# Altium schematic sheet warship_demo_1.SchDoc
size A4
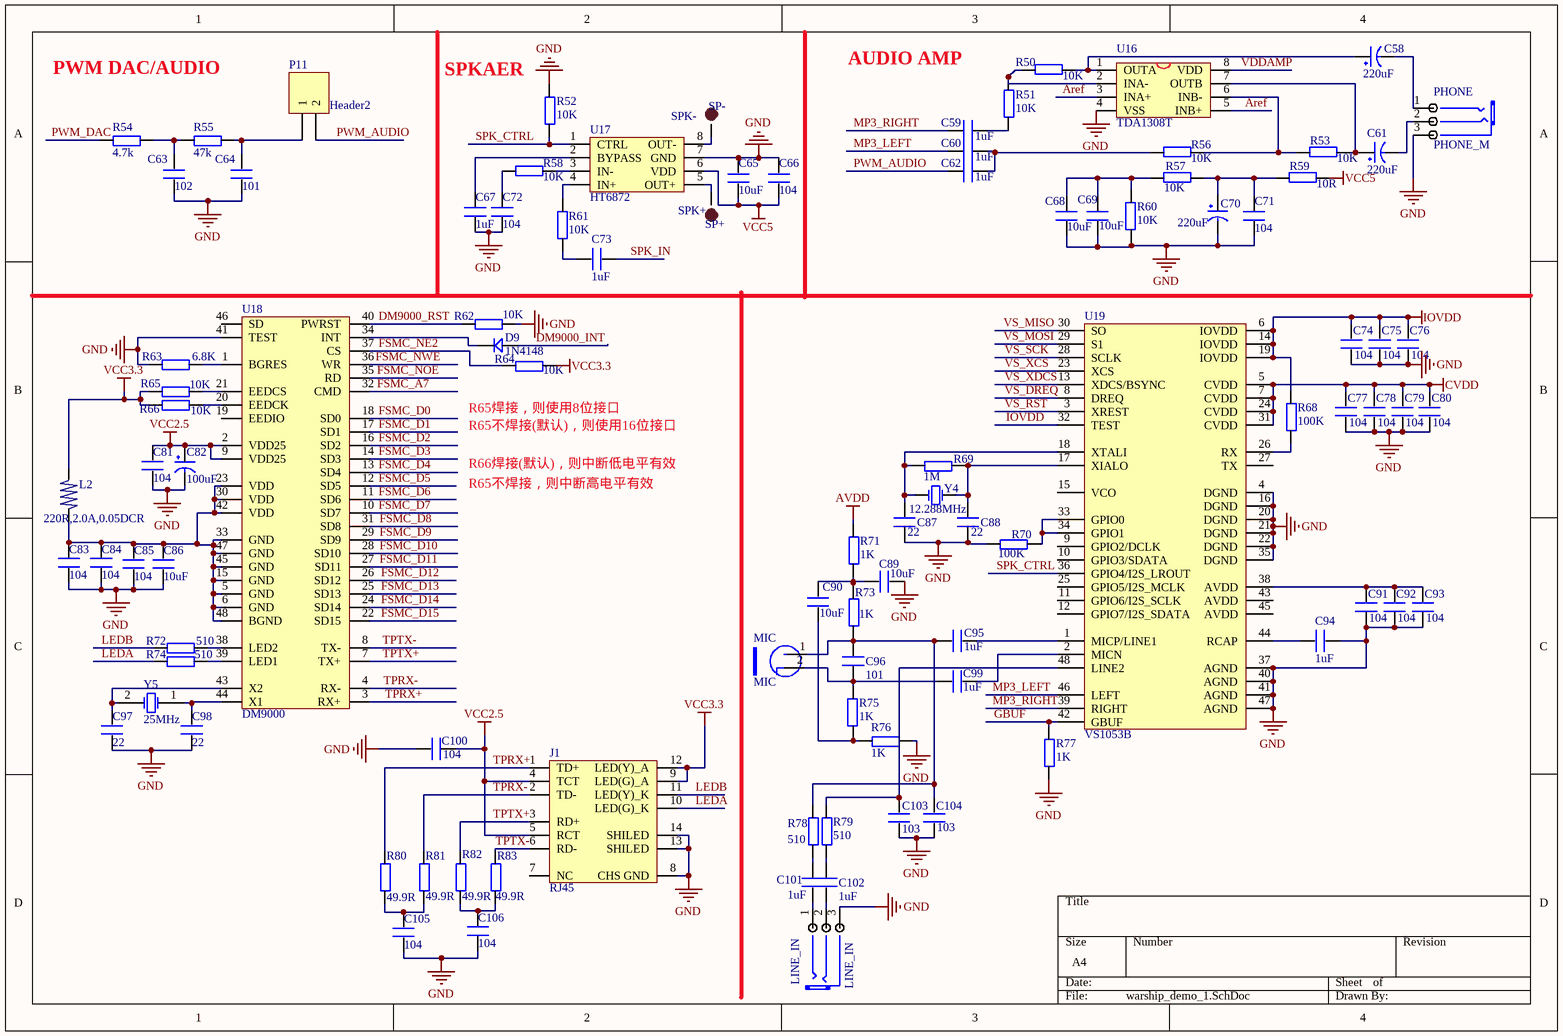
[diagram p0: warship_demo_1.SchDoc]

## Parts
C58  220uF  [CC6.56.5]
C59  1uF  [0603P]
C60  1uF  [0603P]
C61  220uF  [CC6.56.5]
C62  1uF  [0603P]
C63  102  [0603P]
C64  101  [0603P]
C65  10uF  [0603P]
C66  104  [0603P]
C67  1uF  [0603P]
C68  10uF  [0603P]
C69  10uF  [0603P]
C70  220uF  [CC6.56.5]
C71  104  [0603P]
C72  104  [0603P]
C73  1uF  [0603P]
C74  104  [0603P]
C75  104  [0603P]
C76  104  [0603P]
C77  104  [0603P]
C78  104  [0603P]
C79  104  [0603P]
C80  104  [0603P]
C81  104  [0603P]
C82  100uF  [CC6.56.5]
C83  104  [0603P]
C84  104  [0603P]
C85  104  [0603P]
C86  10uF  [0603P]
C87  22  [0603P]
C88  22  [0603P]
C89  10uF  [0603P]
C90  10uF  [0603P]
C91  104  [0603P]
C92  104  [0603P]
C93  104  [0603P]
C94  1uF  [0603P]
C95  1uF  [0603P]
C96  101  [0603P]
C97  22  [0603P]
C98  22  [0603P]
C99  1uF  [0603P]
C100  104  [0603P]
C101  1uF  [0603P]
C102  1uF  [0603P]
C103  103  [0603P]
C104  103  [0603P]
C105  104  [0603P]
C106  104  [0603P]
D9  1N4148  [DIODE_SOP]
J1  RJ45  [HR911105A]
L2  220R,2.0A,0.05DCR  [0603P]
LINE_IN  LINE_IN  [PHONE_ST]
MIC  MIC  [MIC]
P11  Header2  [HDR1X2]
PHONE  PHONE_M  [PHONE_ST]
R50  10K  [0603P]
R51  10K  [0603P]
R52  10K  [0603P]
R53  10K  [0603P]
R54  4.7k  [0603P]
R55  47k  [0603P]
R56  10K  [0603P]
R57  10K  [0603P]
R58  10K  [0603P]
R59  10R  [0603P]
R60  10K  [0603P]
R61  10K  [0603P]
R62  10K  [0603P]
R63  6.8K  [0603P]
R64  10K  [0603P]
R65  10K  [0603P]
R66  10K  [0603P]
R68  100K  [0603P]
R69  1M  [0603P]
R70  100K  [0603P]
R71  1K  [0603P]
R72  510  [0603P]
R73  1K  [0603P]
R74  510  [0603P]
R75  1K  [0603P]
R76  1K  [0603P]
R77  1K  [0603P]
R78  510  [0603P]
R79  510  [0603P]
R80  49.9R  [0603P]
R81  49.9R  [0603P]
R82  49.9R  [0603P]
R83  49.9R  [0603P]
SP+  SPK+  [TP-1.5]
SP-  SPK-  [TP-1.5]
U16  TDA1308T  [SOP-8]
U17  HT6872  [SOP-8]
U18  DM9000  [mTQFP48]
U19  VS1053B  [mTQFP48]
Y4  12.288MHz  [XTAL_US]
Y5  25MHz  [XTAL_US]

## Nets
AVDD: R71.2
CVDD: C77.2 C78.2 C79.2 C80.2 U19.5(CVDD) U19.7(CVDD) U19.24(CVDD) U19.31(CVDD)
GND: C63.1 C64.1 C65.1 C66.1 C67.1 C68.2 C69.2 C70.2(GND) C71.2 C72.1 C74.1 C75.1 C76.1 C77.1 C78.1 C79.1 C80.1 C81.1 C82.2(GND) C83.1 C84.1 C85.1 C86.1 C87.1 C88.2 C89.1 C91.1 C92.1 C93.1 C94.1 C97.1 C98.1 C100.2 C103.1 C104.1 C105.1 C106.1 J1.8(CHS_GND) J1.13(SHILED) J1.14(SHILED) LINE_IN.3(COM) PHONE.3(COM) R52.2 R60.2 R62.2 R63.1 R70.1 R76.2 R77.1 U16.4(VSS) U17.7(GND) U18.41(TEST) U19.4(DGND) U19.16(DGND) U19.20(DGND) U19.21(DGND) U19.22(DGND) U19.35(DGND) U19.37(AGND) U19.40(AGND) U19.41(AGND) U19.47(AGND)
IOVDD: C74.2 C75.2 C76.2 R68.2 U19.6(IOVDD) U19.14(IOVDD) U19.19(IOVDD) U19.32(TEST)
VCC2.5: C81.2 C82.1(VCC) C100.1 J1.4(TCT) J1.5(RCT) U18.2(VDD25) U18.9(VDD25)
VCC3.3: J1.9(LED(G)_A) J1.12(LED(Y)_A) L2.1 R64.2 R65.1 R66.1
VCC5: C65.2 C66.2 R59.1 U17.6(VDD)
Aref: U16.3(INA+) U16.5(INB+)
DM9000_INT: D9.1
DM9000_RST: R62.1 U18.40(PWRST)
FSMC_A7: U18.32(CMD)
FSMC_D0: U18.18(SD0)
FSMC_D1: U18.17(SD1)
FSMC_D2: U18.16(SD2)
FSMC_D3: U18.14(SD3)
FSMC_D4: U18.13(SD4)
FSMC_D5: U18.12(SD5)
FSMC_D6: U18.11(SD6)
FSMC_D7: U18.10(SD7)
FSMC_D8: U18.31(SD8)
FSMC_D9: U18.29(SD9)
FSMC_D10: U18.28(SD10)
FSMC_D11: U18.27(SD11)
FSMC_D12: U18.26(SD12)
FSMC_D13: U18.25(SD13)
FSMC_D14: U18.24(SD14)
FSMC_D15: U18.22(SD15)
FSMC_NE2: R64.1 U18.37(CS)
FSMC_NOE: U18.35(RD)
FSMC_NWE: U18.36(WR)
GBUF: R77.2 U19.42(GBUF)
LEDA: J1.10(LED(G)_K) R74.1
LEDB: J1.11(LED(Y)_K) R72.1
MP3_LEFT: C60.2 U19.46(LEFT)
MP3_RIGHT: C59.2 U19.39(RIGHT)
PWM_AUDIO: C62.2 P11.2
PWM_DAC: R54.1
SPK_CTRL: R52.1 U17.1(CTRL) U19.36(GPIO4/I2S_LROUT)
SPK_IN: C73.1
TPRX+: J1.1(TD+) R80.2 U18.3(RX+)
TPRX-: J1.2(TD-) R81.2 U18.4(RX-)
TPTX+: J1.3(RD+) R82.2 U18.7(TX+)
TPTX-: J1.6(RD-) R83.2 U18.8(TX-)
VDDAMP: U16.8(VDD)
VS_DREQ: U19.8(DREQ)
VS_MISO: U19.30(SO)
VS_MOSI: U19.29(S1)
VS_RST: U19.3(XREST)
VS_SCK: U19.28(SCLK)
VS_XCS: U19.23(XCS)
VS_XDCS: U19.13(XDCS/BSYNC)
NetC58_1: C58.1(VCC) R50.1 U16.1(OUTA)
NetC58_2: C58.2(GND) PHONE.1(CHL)
NetC59_1: C59.1 R51.1
NetC60_1: C60.1 C62.1 R56.2
NetC61_1: C61.1(VCC) R53.1 U16.7(OUTB)
NetC61_2: C61.2(GND) PHONE.2(CHR)
NetC63_2: C63.2 R54.2 R55.1
NetC64_2: C64.2 P11.1 R55.2
NetC67_2: C67.2 U17.2(BYPASS)
NetC68_1: C68.1 C69.1 R57.2 R60.1
NetC70_1: C70.1(VCC) C71.1 R57.1 R59.2
NetC72_2: C72.2 R58.2
NetC73_2: C73.2 R61.2
NetC83_2: C83.2 C84.2 C85.2 C86.2 L2.2 U18.5(GND) U18.6(GND) U18.15(GND) U18.23(VDD) U18.30(VDD) U18.33(GND) U18.42(VDD) U18.45(GND) U18.47(GND) U18.48(BGND)
NetC87_2: C87.2 R69.1 U19.18(XTALI) Y4.1(OSC1)
NetC88_1: C88.1 R69.2 U19.17(XIALO) Y4.2(OSC2)
NetC89_2: C89.2 C90.1 R71.1 R73.2
NetC90_2: C90.2 R75.2 R76.1
NetC91_2: C91.2 C92.2 C93.2 U19.38(AVDD)
NetC94_2: C94.2 U19.44(RCAP)
NetC95_1: C95.1 C96.2 C104.2 MIC.1(VCC) R73.1 R78.2
NetC95_2: C95.2 U19.1(MICP/LINE1)
NetC96_1: C96.1 C99.1 MIC.2(GND) R75.1
NetC97_2: C97.2 U18.43(X2) Y5.2(OSC2)
NetC98_2: C98.2 U18.44(X1) Y5.1(OSC1)
NetC99_2: C99.2 U19.2(MICN)
NetC101_1: C101.1 LINE_IN.1(CHL)
NetC101_2: C101.2 R78.1
NetC102_1: C102.1 LINE_IN.2(CHR)
NetC102_2: C102.2 R79.1
NetC103_2: C103.2 R79.2 U19.48(LINE2)
NetC105_2: C105.2 R80.1 R81.1
NetC106_2: C106.2 R82.1 R83.1
NetD9_2: D9.2 U18.34(INT)
NetR50_2: R50.2 R51.2 U16.2(INA-)
NetR53_2: R53.2 R56.1 U16.6(INB-)
NetR58_1: R58.1 U17.3(IN-)
NetR61_1: R61.1 U17.4(IN+)
NetR63_2: R63.2 U18.1(BGRES)
NetR65_2: R65.2 U18.21(EEDCS)
NetR66_2: R66.2 U18.20(EEDCK)
NetR68_1: R68.1 U19.26(RX)
NetR70_2: R70.2 U19.33(GPIO0) U19.34(GPIO1)
NetR72_2: R72.2 U18.38(LED2)
NetR74_2: R74.2 U18.39(LED1)
NetSP+_1: SP+.1 U17.5(OUT+)
NetSP-_1: SP-.1 U17.8(OUT-)

Not connected (* = marked no-connect by the designer): J1 7(NC); U18 19(EEDIO) 46(SD); U19 9(GPIO2/DCLK) 10(GPIO3/SDATA) 11(GPIO6/I2S_SCLK) 12(GPIO7/I2S_SDATA) 15(VCO) 25(GPIO5/I2S_MCLK) 27(TX) 43(AVDD) 45(AVDD)

## Notes on the sheet
- PWM DAC/AUDIO
- (near R52) SPKAER
- AUDIO AMP
- R65焊接，则使用8位接口
- R65不焊接(默认)，则使用16位接口
- R66焊接(默认)，则中断低电平有效
- R65不焊接，则中断高电平有效

## Library data of the parts
C58 C61 C70 C82 = CAP
C59 C60 C62-C69 C71-C81 C83-C106 = C
D9 = D
J1 = HR911105
L2 = L
LINE_IN = PHONE_M
P11 = Header 2: Header, 2-Pin; LatestRevisionDate: 17-Jul-2002; LatestRevisionNote: Re-released for DXP Platform.; Publisher: Altium Limited
R50-R66 R68-R83 = R
SP+ SP- = TEST-POINT: 测试点
U16 = TDA1308
U17 = HT6871
U18 = DM9000A
U19 = VS1053
Y4 Y5 = XTAL: Crystal Oscillator; Published: 8-Jun-2000; LatestRevisionDate: 17-Jul-2002; LatestRevisionNote: Re-released for DXP Platform.; Publisher: Altium Limited